# EAGLE schematic Rocketry_circuit (EAGLE 9.6.2)
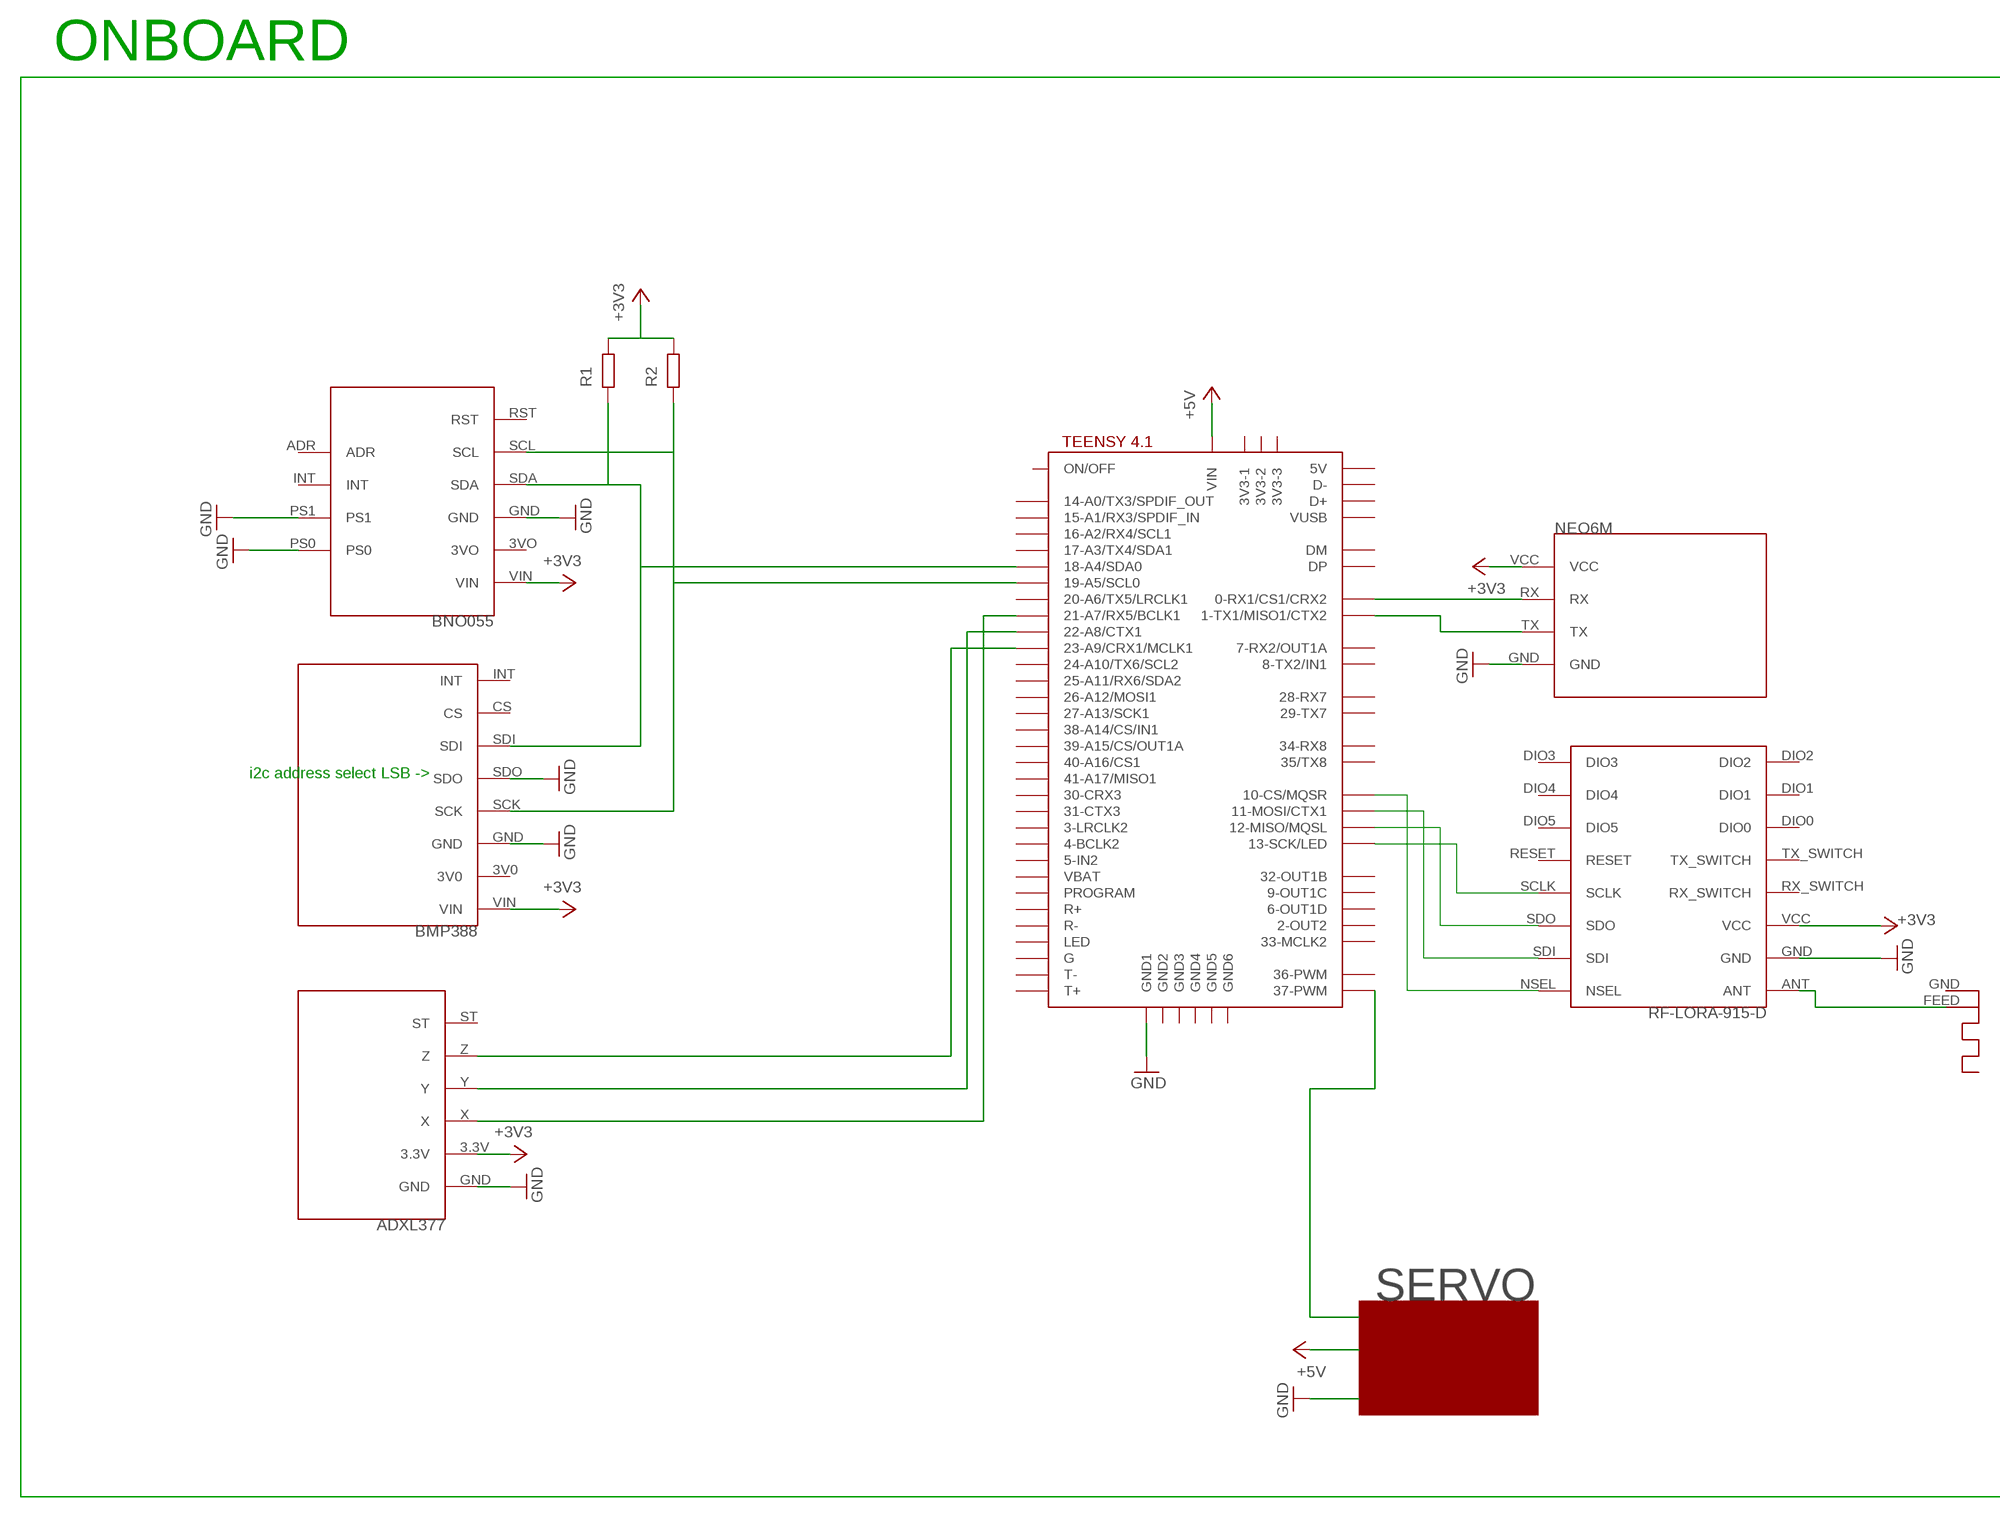
[diagram p0: schematic, sheet 1, part 1 of 2]
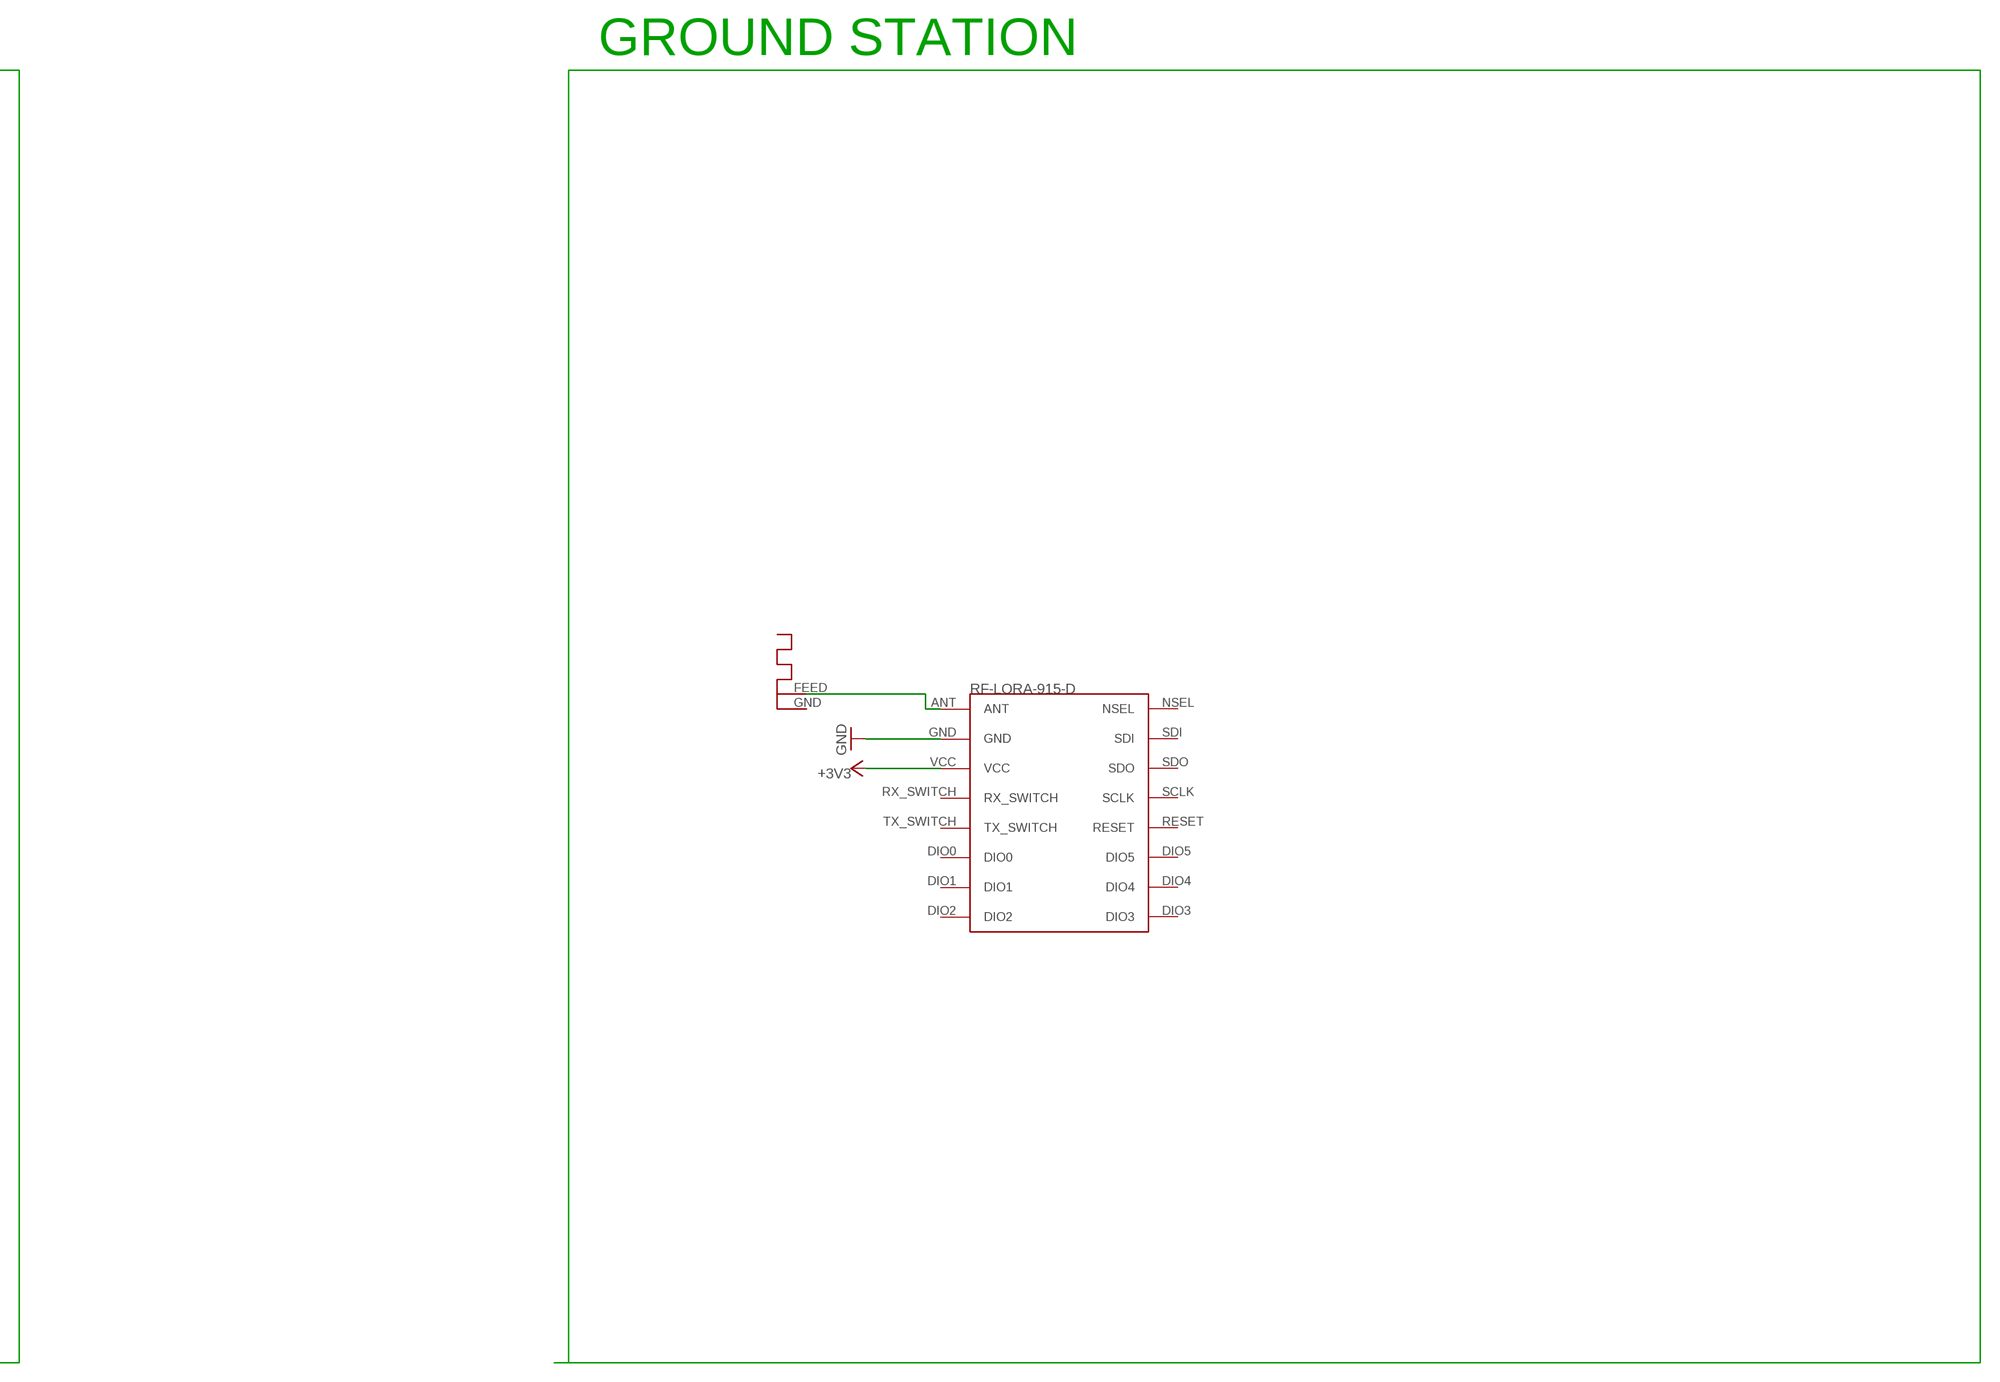
[diagram p1: schematic, sheet 1, part 2 of 2]

## Parts
ANT1  ANTENNA  [RN-ANT]
ANT2  ANTENNA  [RN-ANT]
BRKOUT1  BNO055  [BNO055]
R1  R  (no package)
R2  R  (no package)
U$1  TEENSY41  [TEENSY41]
U$2  BMP388  [BMP388]
U$3  ADXL377  [ADXL377]
U$4  RF-LORA-915-D  [RF-LORA-915-D]
U$5  NEO6M  [NEO6M]
U$6  RF-LORA-915-D  [RF-LORA-915-D]

## Nets
+3V3: BRKOUT1.VIN R1.2 R2.2 U$2.VIN U$3.3.3V U$4.VCC U$5.VCC U$6.VCC
+5V: U$1.VIN
GND: BRKOUT1.GND BRKOUT1.PS0 BRKOUT1.PS1 U$1.GND1 U$2.GND U$2.SDO U$3.GND U$4.GND U$5.GND U$6.GND
N$1: BRKOUT1.SCL R2.1 U$1.19-A5/SCL0 U$2.SCK
N$2: BRKOUT1.SDA R1.1 U$1.18-A4/SDA0 U$2.SDI
N$3: ANT1.FEED U$4.ANT
N$4: U$1.0-RX1/CS1/CRX2 U$5.RX
N$5: U$1.1-TX1/MISO1/CTX2 U$5.TX
N$6: U$1.21-A7/RX5/BCLK1 U$3.X
N$7: U$1.22-A8/CTX1 U$3.Y
N$8: U$1.23-A9/CRX1/MCLK1 U$3.Z
N$9: ANT2.FEED U$6.ANT
N$10: U$1.37-PWM
N$11: U$1.10-CS\MQSR(10-CS/MQSR) U$4.NSEL
N$12: U$1.11-MOSI/CTX1 U$4.SDI
N$13: U$1.12-MISO/MQSL U$4.SDO
N$14: U$1.13-SCK/LED U$4.SCLK
Unconnected: ANT1.GND ANT2.GND BRKOUT1.3VO BRKOUT1.ADR BRKOUT1.INT BRKOUT1.RST U$1.2-OUT2 U$1.3-LRCLK2 U$1.3V3-1 U$1.3V3-2 U$1.3V3-3 U$1.4-BCLK2 U$1.5-IN2 U$1.6-OUT1D U$1.7-RX2/OUT1A U$1.8-TX2/IN2(8-TX2/IN1) U$1.9-OUT1C U$1.14-A0/TX3/SPDIF_OUT U$1.15-A1/RX3/SPDIF_IN U$1.16-A2/RX4/SCL1 U$1.17-A3/TX4/SDA1 U$1.20-A6/TX5/LRCLK1 U$1.24-A10/TX6/SCL2 U$1.25-A11/RX6/SDA2 U$1.26-A12/MOSI1 U$1.27-A13/SCK1 U$1.28-RX7 U$1.29-TX7 U$1.30-CRX3 U$1.31-CTX3 U$1.32-OUT1B U$1.33-MCLK2 U$1.34-RX8 U$1.35-TX8(35/TX8) U$1.36-PWM U$1.38-A14/CS/IN1 U$1.39-A15/CS/OUT1A U$1.40-A16/CS1 U$1.41-A17/MISO1 U$1.+5V(5V) U$1.D+ U$1.D- U$1.DM U$1.DP U$1.G U$1.GND2 U$1.GND3 U$1.GND4 U$1.GND5 U$1.GND6 U$1.LED U$1.ON/OFF U$1.PROGRAM U$1.R+ U$1.R- U$1.T+ U$1.T- U$1.VBAT U$1.VUSB U$2.3V0 U$2.CS U$2.INT U$3.ST U$4.DIO0 U$4.DIO1 U$4.DIO2 U$4.DIO3 U$4.DIO4 U$4.DIO5 U$4.RESET U$4.RX_SWITCH U$4.TX_SWITCH U$6.DIO0 U$6.DIO1 U$6.DIO2 U$6.DIO3 U$6.DIO4 U$6.DIO5 U$6.NSEL U$6.RESET U$6.RX_SWITCH U$6.SCLK U$6.SDI U$6.SDO U$6.TX_SWITCH

## Notes on the sheet
- ONBOARD | GROUND STATION
- i2c address select LSB ->
- SERVO

## Library data of the parts
ANT1 ANT2 = adafruit:ANTENNA
BRKOUT1 = BNO055:BNO055: A BNO055 breakout board by adafruit
R1 R2 = ngspice-simulation:R: RESISTOR
U$1 = teensy:TEENSY41
U$2 = BMP388:BMP388
U$3 = ADXL377:ADXL377
U$4 U$6 = RF-LORA-915-D:RF-LORA-915-D
U$5 = NEO6M:NEO6M